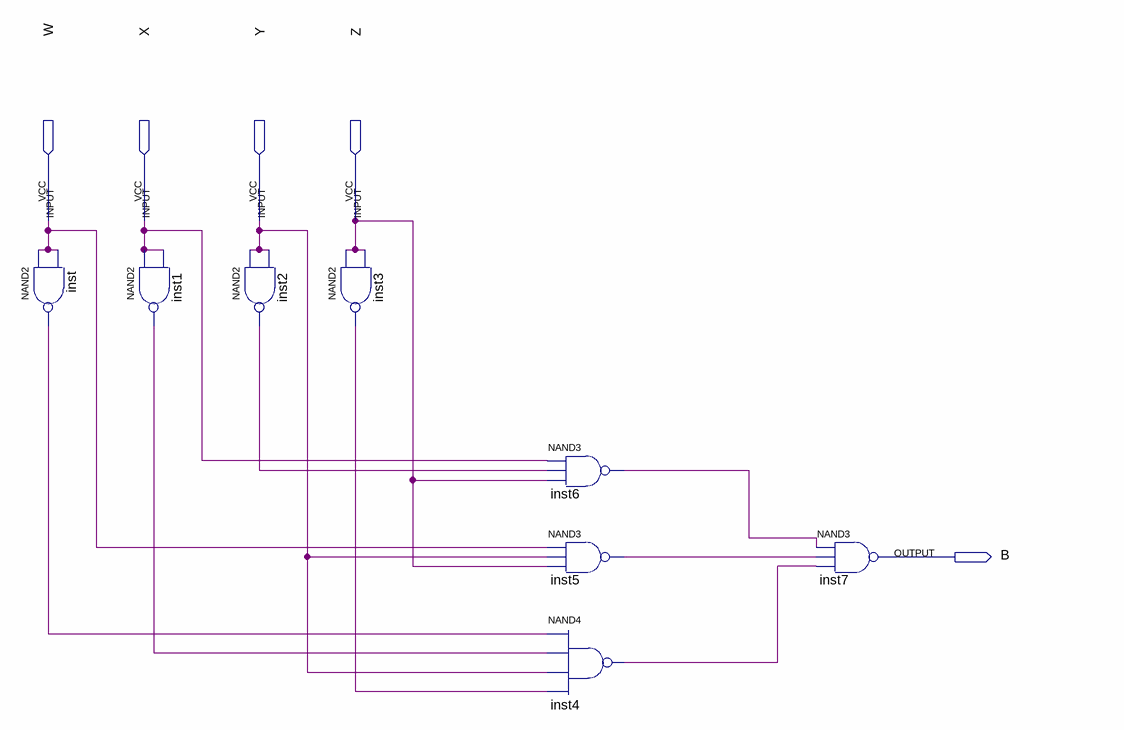
[diagram p0: schematic sheet]
// Quartus schematic Block1.bdf as structural Verilog: 8 symbols, 5 pins
module Block1 (
  input  W,
  input  X,
  input  Y,
  input  Z,
  output B
);

  wire inst1_out, inst2_out, inst3_out, inst4_out, inst5_out, inst6_out, inst_out;

  nand inst (inst_out, W, W);
  nand inst1 (inst1_out, X, X);
  nand inst2 (inst2_out, Y, Y);
  nand inst3 (inst3_out, Z, Z);
  nand inst6 (inst6_out, X, inst2_out, Z);
  nand inst5 (inst5_out, W, Y, Z);
  nand inst4 (inst4_out, inst_out, inst1_out, Y, inst3_out);
  nand inst7 (B, inst6_out, inst5_out, inst4_out);
endmodule
